# Altium schematic sheet Sheet1.SchDoc
size 594 x 420 mm; SheetNumber: 1; SheetTotal: 1
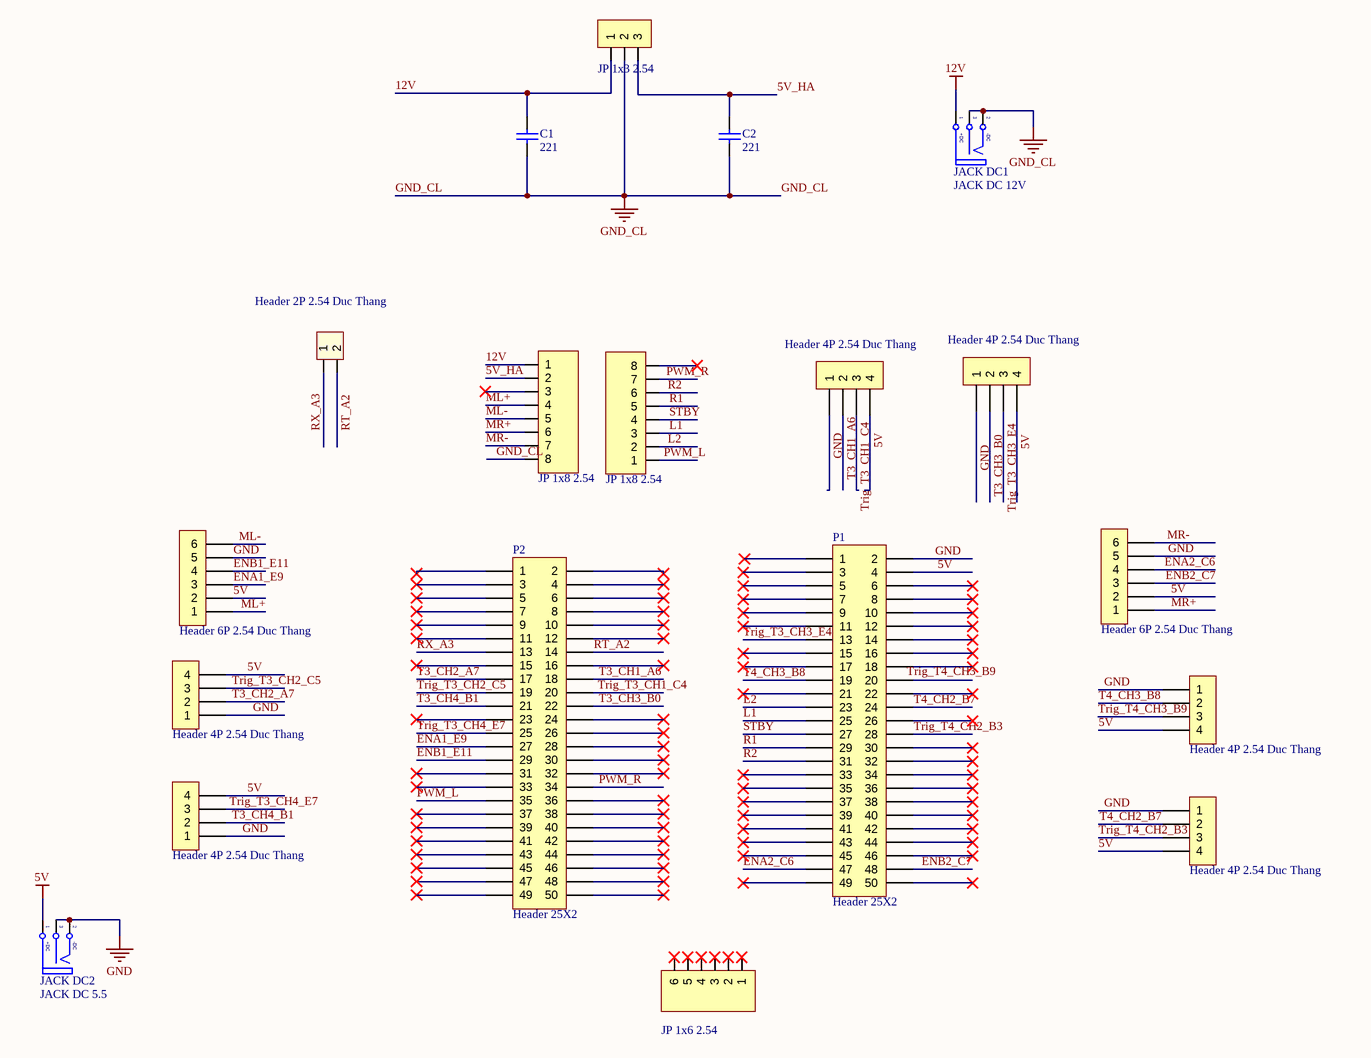
[diagram p0: Sheet1.SchDoc]

## Parts
C1  221  [tu gom]
C2  221  [tu gom]
H1  Header 2P 2.54 Duc Thang  [XH2.54M-2]
H2  Header 4P 2.54 Duc Thang  [XH2.54M-4]
H3  Header 4P 2.54 Duc Thang  [XH2.54M-4]
H4  Header 6P 2.54 Duc Thang  [XH2.54M-6]
H5  Header 6P 2.54 Duc Thang  [XH2.54M-6]
H6  Header 4P 2.54 Duc Thang  [XH2.54M-4]
H7  Header 4P 2.54 Duc Thang  [XH2.54M-4]
H8  Header 4P 2.54 Duc Thang  [XH2.54M-4]
H9  Header 4P 2.54 Duc Thang  [XH2.54M-4]
JACK_DC1  JACK DC 12V  [JACK DC 5.5]
JACK_DC2  JACK DC 5.5  [JACK DC 5.5]
JP1  JP 1x3 2.54  [JP 1x3 CT]
JP2  JP 1x8 2.54  [JP 1x8 CT]
JP3  JP 1x8 2.54  [JP 1x8 CT]
JP4  JP 1x6 2.54  [JP 1x6 CT]
P1  Header 25X2  [HDR2X25]
P2  Header 25X2  [HDR2X25]

## Nets
5V: H2.4 H3.4 H4.2 H5.2 H6.4 H7.4 H8.4 H9.4 JACK_DC2.1(T) P1.4
12V: C1.1 JACK_DC1.1(T) JP1.1 JP2.1
GND: H2.1 H3.1 H4.5 H5.5 H6.1 H7.1 H8.1 H9.1 JACK_DC2.2(TN) JACK_DC2.3(S) P1.2
GND_CL: C1.2 C2.2 JACK_DC1.2(TN) JACK_DC1.3(S) JP1.2 JP2.8
5V_HA: C2.1 JP1.3 JP2.2
ENA1_E9: H4.3 P2.27
ENA2_C6: H5.4 P1.47
ENB1_E11: H4.4 P2.29
ENB2_C7: H5.3 P1.48
L1: JP3.3 P1.25
L2: JP3.2 P1.23
ML+: H4.1 JP2.4
ML-: H4.6 JP2.5
MR+: H5.1 JP2.6
MR-: H5.6 JP2.7
PWM_L: JP3.1 P2.35
PWM_R: JP3.7 P2.34
R1: JP3.5 P1.29
R2: JP3.6 P1.31
RT_A2: H1.2 P2.14
RX_A3: H1.1 P2.13
STBY: JP3.4 P1.27
T3_CH1_A6: H3.2 P2.18
T3_CH2_A7: H6.2 P2.17
T3_CH3_B0: H2.2 P2.22
T3_CH4_B1: H8.2 P2.21
T4_CH2_B7: H9.2 P1.24
T4_CH3_B8: H7.2 P1.19
Trig_T3_CH1_C4: H3.3 P2.20
Trig_T3_CH2_C5: H6.3 P2.19
Trig_T3_CH3_E4: H2.3 P1.13
Trig_T3_CH4_E7: H8.3 P2.25
Trig_T4_CH2_B3: H9.3 P1.28
Trig_T4_CH3_B9: H7.3

Not connected (* = marked no-connect by the designer): JP2 3*; JP3 8*; JP4 1* 2* 3* 4* 5* 6*; P1 1* 3* 5* 6* 7* 8* 9* 10* 11* 12* 14* 15* 16* 17* 18* 20 21* 22* 26* 30* 32* 33* 34* 35* 36* 37* 38* 39* 40* 41* 42* 43* 44* 45* 46* 49* 50*; P2 1* 2* 3* 4* 5* 6* 7* 8* 9* 10* 11* 12* 15* 16* 23* 24* 26* 28* 30* 31* 32* 33* 36* 37* 38* 39* 40* 41* 42* 43* 44* 45* 46* 47* 48* 49* 50*

## Notes on the sheet
- Labels drawn without touching a wire or pin: Trig_T4_CH3_B9
- DWG NO:
- REV:
- THIS DOCUMENT AND THE DATA DISCLOSED HEREIN OR
- HEREWITH IS THE PROPERTY OF ALTIUM LIMITED AND MAY
- BE FREELY DISTRIBUTED IN WHOLE. NO RIGHTS ARE
- RESERVED OR EXPRESS OR IMPLIED WARANTEE GIVEN.
- REVISION
- DESCRIPTION
- DATE
- APPROVED
- ENG:
- APPROVALS
- PROJECT
- DSN:
- CHK:
- REFERENCE DOCUMENTS
- PROJECT REVISION:
- TITLE
- DOCUMENT REVISION:
- DESIGN ITEM:
- BOM:
- FAB DWG:
- PCB DWG:
- ASSY DWG:
- SCALE:
- A2
- SIZE
- CAGE CODE
- FILE NAME
- DWG NO.
- SHEET
- OF
- REV
- (in symbol JACK DC 5.5) +DC; -DC

## Library data of the parts
C1 C2 = Tu gom 221 50V: Cắm; Don_Vi: Con; So_Chan: 2; Ten_Linh_Kien: Tụ gốm 220P 221 50V; Ma_Hang: MH004769; Chung_Loai: Cắm; Kieu_Chan: *
H1 = Header 2P 2.54 Duc Thang: Cắm; Ten_Linh_Kien: Header 2P XH2.54-2P Đực Thẳng; Don_Vi: Con; Ma_Hang: MH001283; Chung_Loai: Cắm
H2 H3 H6-H9 = Header 4P 2.54 Duc Thang: Cắm; Ten_Linh_Kien: Header 4P XH2.54-4P Đực Thẳng; Don_Vi: Con; Ma_Hang: MH001285; Chung_Loai: Cắm
H4 H5 = Header 6P 2.54 Duc Thang: Cắm; Ten_Linh_Kien: Header 6P XH2.54-6P Đực Thẳng; Don_Vi: Con; Ma_Hang: MH001972; Chung_Loai: Cắm
JACK_DC1 JACK_DC2 = JACK DC 5.5: Value: Jac DC
JP1 = JP 1x3 2.54 Cai Thang: Cắm; Ten_Linh_Kien: Jump Đơn Cái 2.54MM 1x20P Thẳng; Don_Vi: Con; Ma_Hang: MH004006; Ghi_Chu: *; Kieu_Chan: *; Chung_Loai: Cắm
JP2 JP3 = JP 1x8 2.54 Cai Thang: Cắm; Ten_Linh_Kien: Jump Đơn Cái 2.54MM 1x20P Thẳng; Don_Vi: Con; Ma_Hang: MH004006; Ghi_Chu: *; Kieu_Chan: *; Chung_Loai: Cắm
JP4 = JP 1x6 2.54 Cai Thang: Cắm; Ten_Linh_Kien: Jump Đơn Cái 2.54MM 1x20P Thẳng; Don_Vi: Con; Ma_Hang: MH004006; Ghi_Chu: *; Kieu_Chan: *; Chung_Loai: Cắm
P1 P2 = Header 25X2: Header, 25-Pin, Dual row; LatestRevisionDate: 17-Jul-2002; LatestRevisionNote: Re-released for DXP Platform.; Publisher: Altium Limited